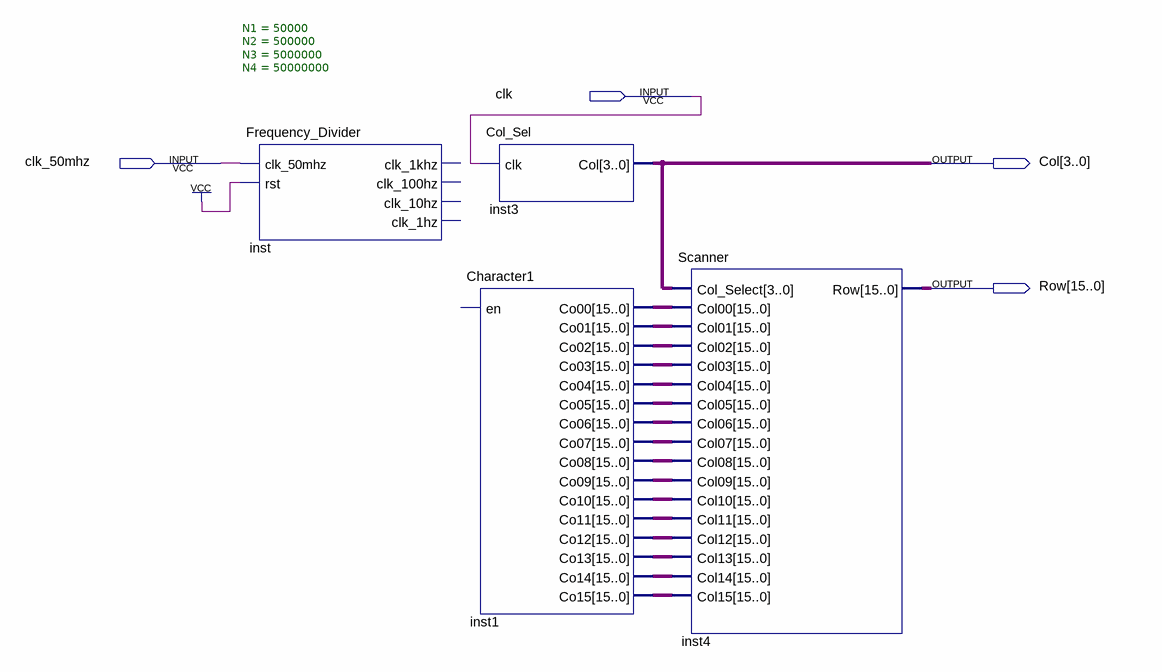
[diagram p0: schematic sheet]
// Quartus schematic NameDispaly.bdf as structural Verilog: 4 symbols, 4 pins
module NameDispaly (
  input  clk,
  input  clk_50mhz,
  output [3:0] Col,
  output [15:0] Row
);

  wire [15:0] inst1_co00, inst1_co01, inst1_co02, inst1_co03, inst1_co04, inst1_co05, inst1_co06, inst1_co07,
       inst1_co08, inst1_co09, inst1_co10, inst1_co11, inst1_co12, inst1_co13, inst1_co14, inst1_co15;

  Frequency_Divider #(.N1(50000), .N2(500000), .N3(5000000), .N4(50000000)) inst (
    .clk_50mhz(clk_50mhz), .rst(1'b1));  // open: clk_1khz, clk_100hz, clk_10hz, clk_1hz
  Character1 inst1 (
    .Co00(inst1_co00), .Co01(inst1_co01), .Co02(inst1_co02), .Co03(inst1_co03), .Co04(inst1_co04),
    .Co05(inst1_co05), .Co06(inst1_co06), .Co07(inst1_co07), .Co08(inst1_co08), .Co09(inst1_co09),
    .Co10(inst1_co10), .Co11(inst1_co11), .Co12(inst1_co12), .Co13(inst1_co13), .Co14(inst1_co14),
    .Co15(inst1_co15));  // open: en
  Col_Sel inst3 (.clk(clk), .Col(Col));
  Scanner inst4 (
    .Col_Select(Col), .Col00(inst1_co00), .Col01(inst1_co01), .Col02(inst1_co02), .Col03(inst1_co03),
    .Col04(inst1_co04), .Col05(inst1_co05), .Col06(inst1_co06), .Col07(inst1_co07), .Col08(inst1_co08),
    .Col09(inst1_co09), .Col10(inst1_co10), .Col11(inst1_co11), .Col12(inst1_co12), .Col13(inst1_co13),
    .Col14(inst1_co14), .Col15(inst1_co15), .Row(Row));
endmodule
